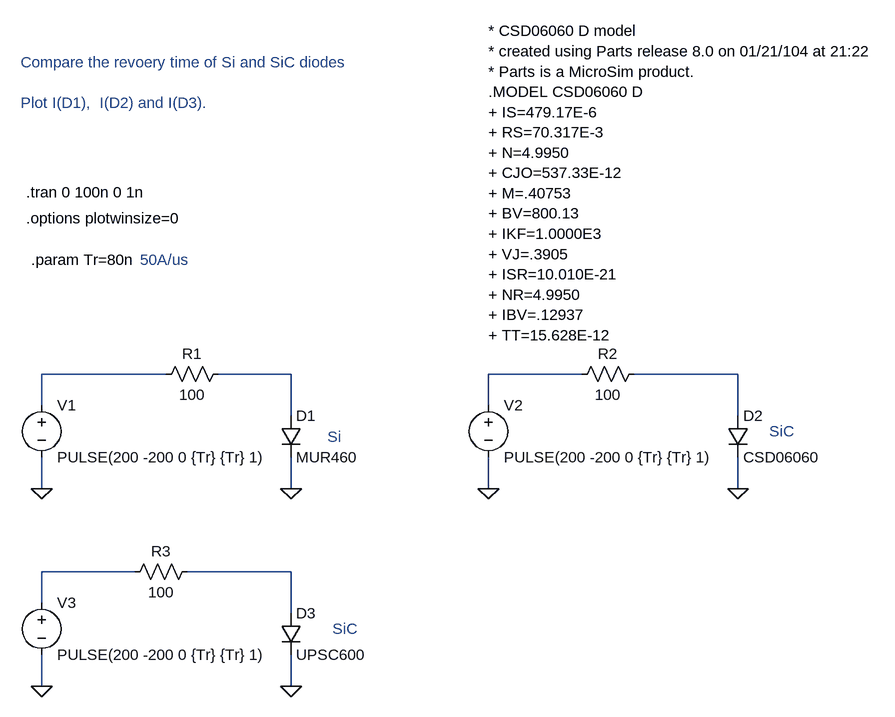
[diagram p0: schematic SiC_recovery1.asc]
SiC_recovery1.asc, the LTspice schematic file:
Version 4
SHEET 1 1800 1012
WIRE -160 240 -160 192
WIRE -160 368 -160 320
WIRE -160 544 -160 496
WIRE -160 672 -160 624
WIRE -16 496 -160 496
WIRE 32 192 -160 192
WIRE 224 192 112 192
WIRE 224 256 224 192
WIRE 224 368 224 320
WIRE 224 496 64 496
WIRE 224 560 224 496
WIRE 224 672 224 624
WIRE 528 240 528 192
WIRE 528 368 528 320
WIRE 672 192 528 192
WIRE 912 192 752 192
WIRE 912 256 912 192
WIRE 912 368 912 320
FLAG -160 368 0
FLAG 224 368 0
FLAG 528 368 0
FLAG 912 368 0
FLAG -160 672 0
FLAG 224 672 0
SYMBOL diode 208 256 R0
SYMATTR InstName D1
SYMATTR Value MUR460
SYMBOL res 16 208 R270
WINDOW 0 32 56 VTop 0
WINDOW 3 0 56 VBottom 0
SYMATTR InstName R1
SYMATTR Value 100
SYMBOL voltage -160 224 R0
WINDOW 123 0 0 Left 0
WINDOW 39 0 0 Left 0
SYMATTR InstName V1
SYMATTR Value PULSE(200 -200 0 {Tr} {Tr} 1)
SYMBOL diode 896 256 R0
SYMATTR InstName D2
SYMATTR Value CSD06060
SYMBOL res 656 208 R270
WINDOW 0 32 56 VTop 0
WINDOW 3 0 56 VBottom 0
SYMATTR InstName R2
SYMATTR Value 100
SYMBOL voltage 528 224 R0
WINDOW 123 0 0 Left 0
WINDOW 39 0 0 Left 0
SYMATTR InstName V2
SYMATTR Value PULSE(200 -200 0 {Tr} {Tr} 1)
SYMBOL diode 208 560 R0
SYMATTR InstName D3
SYMATTR Value UPSC600
SYMBOL res -32 512 R270
WINDOW 0 32 56 VTop 0
WINDOW 3 0 56 VBottom 0
SYMATTR InstName R3
SYMATTR Value 100
SYMBOL voltage -160 528 R0
WINDOW 123 0 0 Left 0
WINDOW 39 0 0 Left 0
SYMATTR InstName V3
SYMATTR Value PULSE(200 -200 0 {Tr} {Tr} 1)
TEXT 528 -336 Left 0 !* CSD06060 D model\n* created using Parts release 8.0 on 01/21/104 at 21:22\n* Parts is a MicroSim product.\n.MODEL CSD06060 D\n+ IS=479.17E-6\n+ RS=70.317E-3\n+ N=4.9950\n+ CJO=537.33E-12\n+ M=.40753\n+ BV=800.13\n+ IKF=1.0000E3\n+ VJ=.3905\n+ ISR=10.010E-21\n+ NR=4.9950\n+ IBV=.12937\n+ TT=15.628E-12
TEXT -184 -88 Left 0 !.tran 0 100n 0 1n
TEXT -184 -48 Left 0 !.options plotwinsize=0
TEXT -192 -288 Left 0 ;Compare the revoery time of Si and SiC diodes\n \nPlot I(D1),  I(D2) and I(D3).
TEXT -176 16 Left 0 !.param Tr=80n
TEXT -8 16 Left 0 ;50A/us
TEXT 280 288 Left 0 ;Si
TEXT 960 280 Left 0 ;SiC
TEXT 288 584 Left 0 ;SiC

The netlist it stands for:
* SiC_recovery1.asc
D1 N003 0 MUR460
R1 N001 N003 100
V1 N001 0 PULSE(200 -200 0 {Tr} {Tr} 1)
D2 N006 0 CSD06060
R2 N005 N006 100
V2 N005 0 PULSE(200 -200 0 {Tr} {Tr} 1)
D3 N004 0 UPSC600
R3 N002 N004 100
V3 N002 0 PULSE(200 -200 0 {Tr} {Tr} 1)
.model D D
.lib standard.dio
* CSD06060 D model
* created using Parts release 8.0 on 01/21/104 at 21:22
* Parts is a MicroSim product.
.MODEL CSD06060 D
+ IS=479.17E-6
+ RS=70.317E-3
+ N=4.9950
+ CJO=537.33E-12
+ M=.40753
+ BV=800.13
+ IKF=1.0000E3
+ VJ=.3905
+ ISR=10.010E-21
+ NR=4.9950
+ IBV=.12937
+ TT=15.628E-12
.tran 0 100n 0 1n
.options plotwinsize=0
* Compare the revoery time of Si and SiC diodes
* Plot I(D1),  I(D2) and I(D3).
.param Tr=80n
* 50A/us
* Si
* SiC
* SiC
.backanno
.end